# EAGLE design preamp (EAGLE 7.4.0)
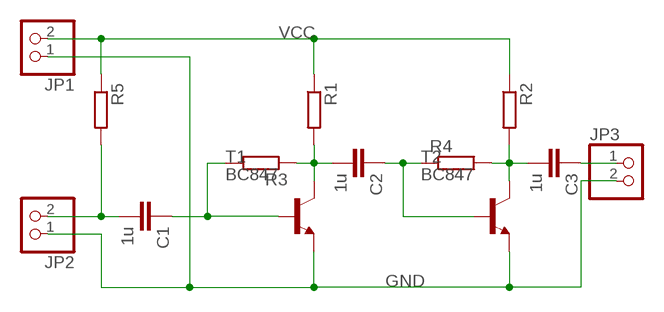
[diagram p0: schematic, sheet 1]

## Parts
C1  1u  C-EUC0805  [C0805]
C2  1u  C-EUC0805  [C0805]
C3  1u  C-EUC0805  [C0805]
JP1  PINHD-1X2  [1X02]
JP2  PINHD-1X2  [1X02]
JP3  PINHD-1X2  [1X02]
R1  R-EU_R0805  [R0805]
R2  R-EU_R0805  [R0805]
R3  R-EU_R0805  [R0805]
R4  R-EU_R0805  [R0805]
R5  R-EU_R0805  [R0805]
T1  BC847  [SOT23]
T2  BC847  [SOT23]

## Nets
GND: JP1.1 JP2.1 JP3.2 T1.2(E) T2.2(E)
N$1: C1.2 JP2.2 R5.2
N$2: C1.1 R3.2 T1.1(B)
N$3: C2.2 R1.2 R3.1 T1.3(C)
N$4: C2.1 R4.1 T2.1(B)
N$5: C3.2 R2.2 R4.2 T2.3(C)
N$6: C3.1 JP3.1
VCC: JP1.2 R1.1 R2.1 R5.1

## Library data of the parts
C1-C3 = rcl:C-EU: CAPACITOR, European symbol
JP1-JP3 = pinhead:PINHD-1X2: PIN HEADER
R1-R5 = rcl:R-EU_: RESISTOR, European symbol
T1 T2 = transistor:BC847: NPN TRANSISTOR

## Board
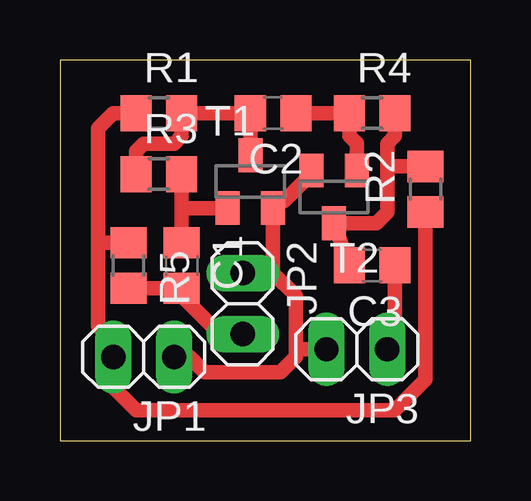
[diagram p1: board, top side]

Size 17.12 x 15.86 mm. Coordinates in mm from the lower left corner, seen from the top.
Outline: 0,0 17.12,0 17.12,15.86 0,15.86 0,0
Copper layers (1*16): Top 0.035mm / dielectric 1.5mm / Bottom 0.035mm
Design rules "default": minimum track width 10mil, minimum drill 24mil, track to track 8mil, track to pad 8mil, pad to pad 8mil, via to via 8mil, smd to smd 8mil, copper to edge 40mil, drill to drill 8mil, minimum pad ring 10mil, minimum via ring 8mil, stop-mask expansion 4mil, vias tented up to drill 0mil, thermal gap 10mil

### Footprints (pad centres in the part's own frame; a part is rotated, then mirrored left to right if it is on the bottom)
C0805 = smd 1.3 x 1.5: 1 -0.95,0; 2 0.95,0
1X02 = drill 1.016 long: 1 -1.27,0; 2 1.27,0
R0805 = smd 1.3 x 1.5: 1 -0.95,0; 2 0.95,0
SOT23 = smd 1 x 1.4: 1 -0.95,-1.1; 2 0.95,-1.1; 3 0,1.1

### Placement (x,y rotation side)
C1  5.08,7.3 270 top
C2  8.89,13.65 180 top
C3  13.02,7.3 180 top
JP1  3.49,3.49 180 top
JP2  7.62,5.71 270 top
JP3  12.38,3.81 180 top
R1  4.13,13.65 0 top
R2  15.24,10.48 90 top
R3  4.13,11.11 0 top
R4  13.02,13.65 0 top
R5  2.86,7.3 270 top
T1  7.94,10.79 0 top
T2  11.43,10.16 180 top

### Tracks (layer width: path | path; a pad name or v marks a point on that pad's centre or on a via)
GND
  Top 0.61: T2.2 10.65,11.11 10.48,11.11 9.38,10.01 T1.2 8.89,6.98 JP2.1 8.89,6.99 9.84,6.03 9.84,3.81 | JP1.1 5.4,3.49 6.03,2.86 9.21,2.86 9.84,3.49 9.84,3.81 | JP3.2 9.84,3.81
N$1
  Top 0.61: R5.2 C1.2 5.08,6.03 6.67,4.45 JP2.2
N$2
  Top 0.61: R3.2 5.08,9.53 | 5.08,9.53 C1.1 | T1.1 5.25,9.7 5.08,9.53
N$3
  Top 0.61: T1.3 C2.2 R1.2 5.08,13.97 5.08,12.7 4.76,12.38 3.49,12.38 3.18,12.07 R3.1
N$4
  Top 0.61: T2.1 12.38,12.38 12.06,12.7 R4.1 C2.1
N$5
  Top 0.61: C3.2 T2.3 13.19,9.06 13.65,9.53 13.65,12.06 | 13.65,12.06 13.65,11.43 14.92,11.43 R2.2 | R4.2 13.97,12.7 13.65,12.38 13.65,12.06
N$6
  Top 0.61: C3.1 13.97,4.12 JP3.1
VCC
  Top 0.61: 1.59,8.26 1.59,4.76 2.22,4.13 JP1.2 2.22,2.22 3.17,1.27 13.97,1.27 15.24,2.54 R2.1 | R5.1 1.91,8.26 1.59,8.26 | R1.1 2.22,13.65 1.59,13.02 1.59,8.26